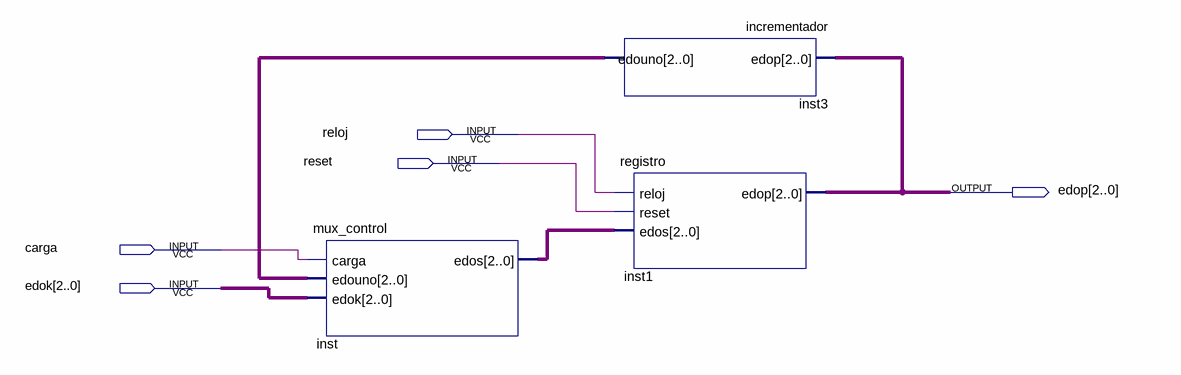
[diagram p0: schematic sheet]
// Quartus schematic contador.bdf as structural Verilog: 3 symbols, 5 pins
module contador (
  input  reloj,
  input  reset,
  input  carga,
  input  [2:0] edok,
  output [2:0] edop
);

  wire [2:0] inst3_edouno, inst_edos;

  mux_control inst (.carga(carga), .edouno(inst3_edouno), .edok(edok), .edos(inst_edos));
  incrementador inst3 (.edop(edop), .edouno(inst3_edouno));
  registro inst1 (.reloj(reloj), .reset(reset), .edos(inst_edos), .edop(edop));
endmodule
